# EAGLE design DryerSignal (EAGLE 8.3.2)
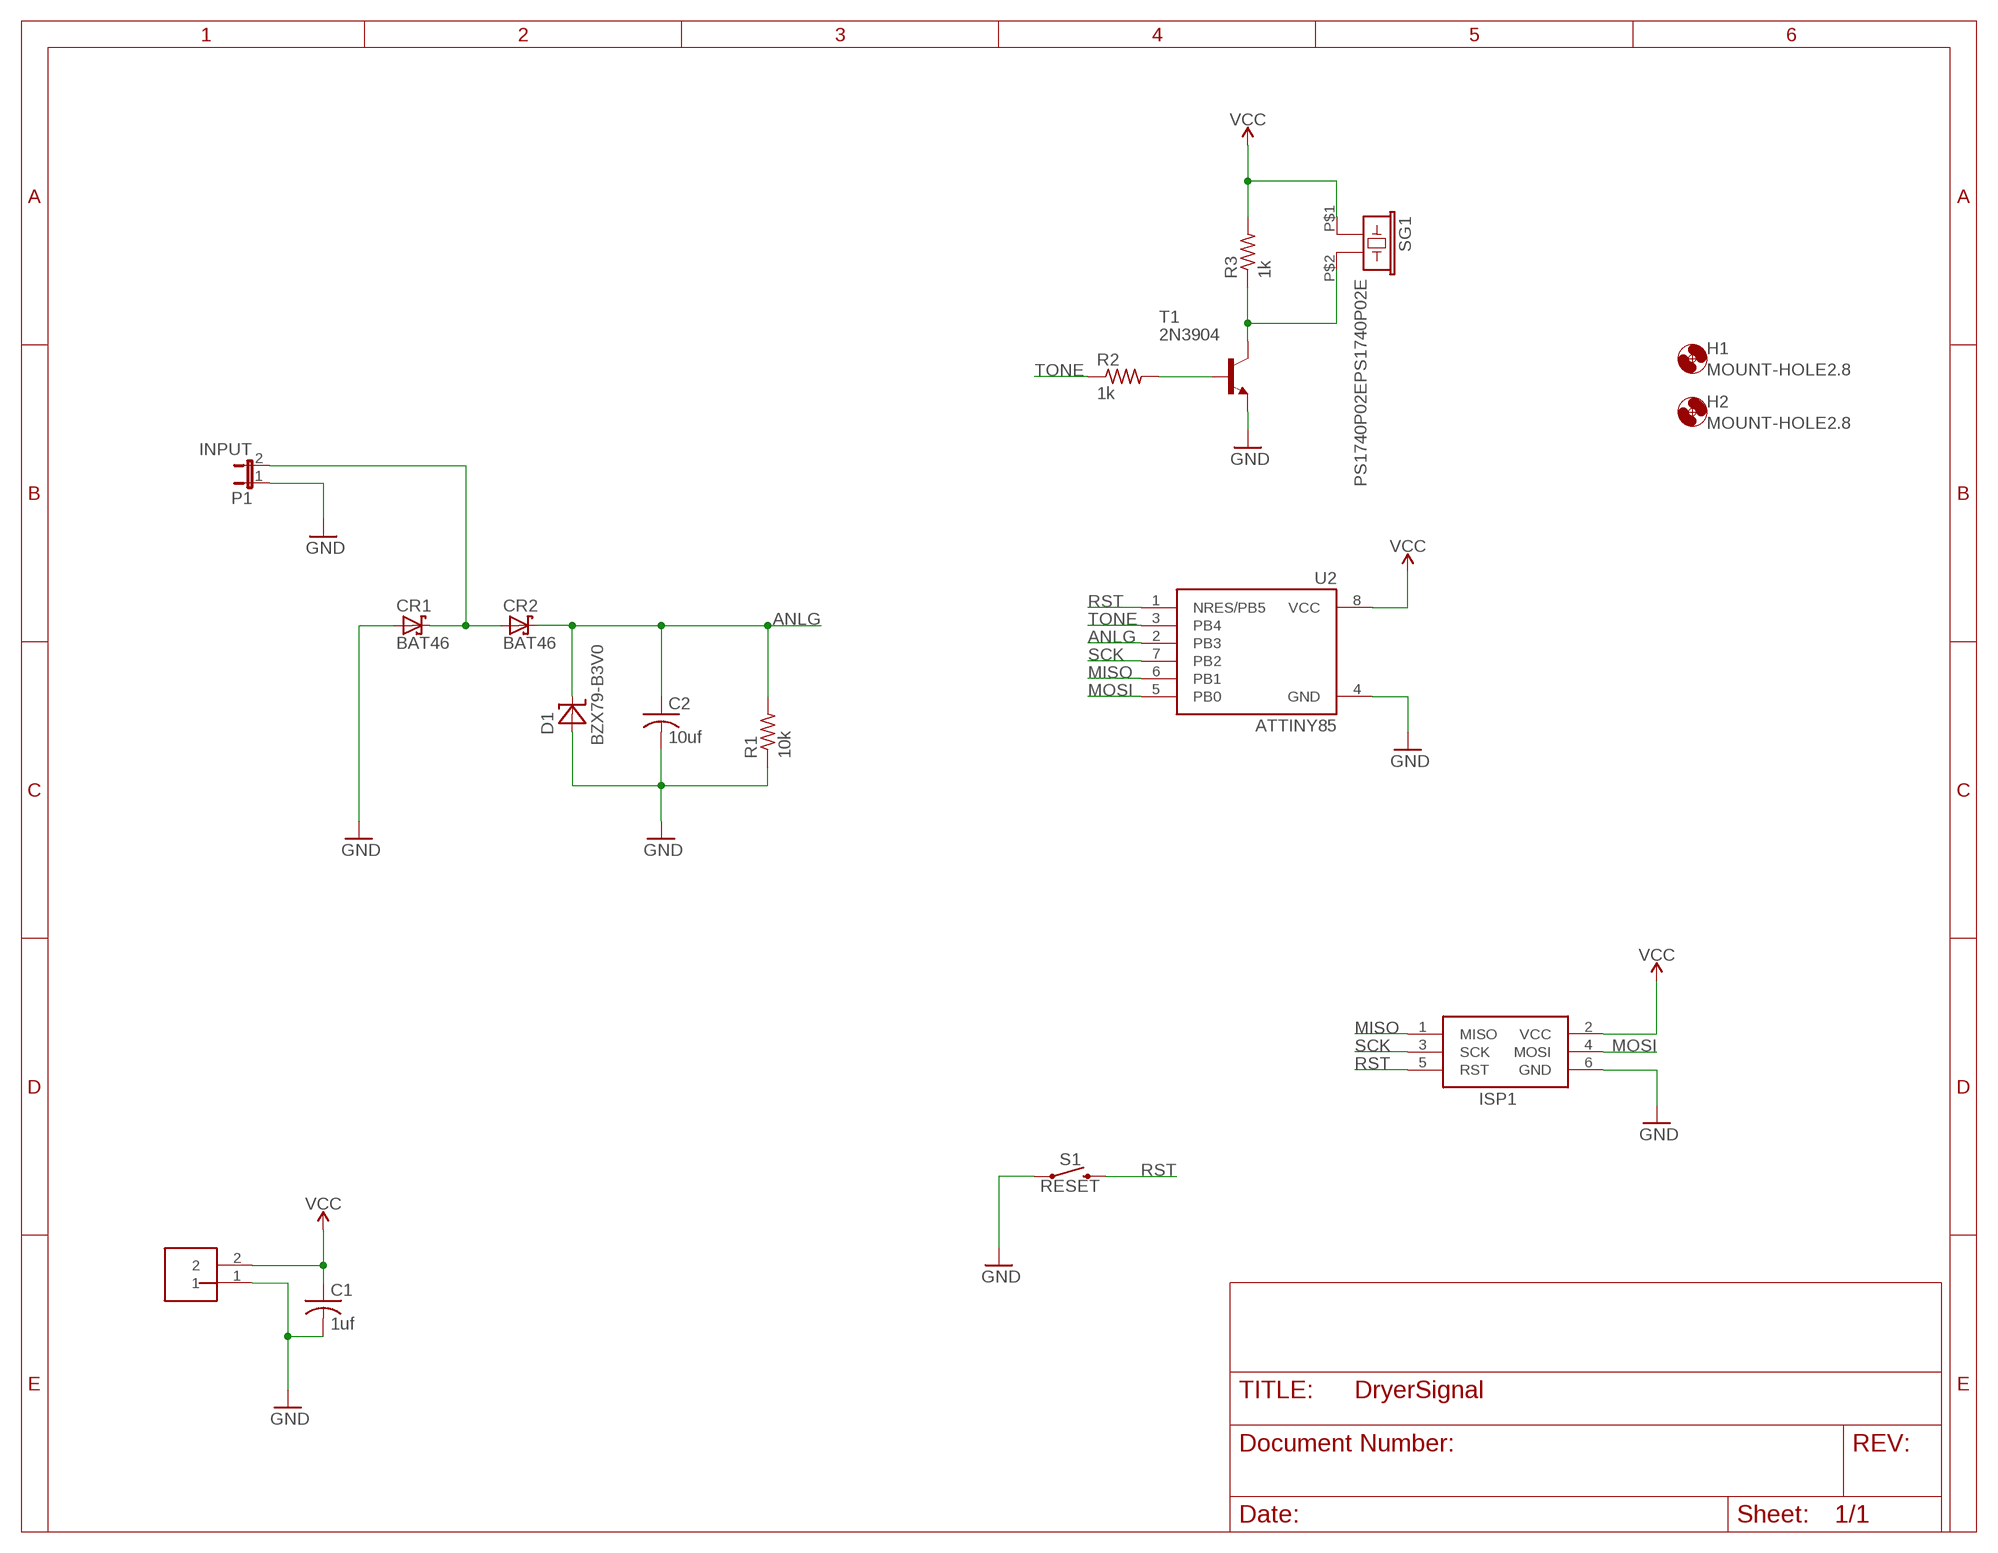
[diagram p0: schematic, sheet 1]

## Parts
C1  1uf  C-US050-025X075  [C050-025X075]
C2  10uf  C-US050-025X075  [C050-025X075]
CR1  BAT46  [DO35-10]
CR2  BAT46  [DO35-10]
D1  BZX79-B3V0  BZX79  [DO35-10]
H1  MOUNT-HOLE2.8  [2,8]
H2  MOUNT-HOLE2.8  [2,8]
ISP1  AVRISP-BOX  [AVRISP-BOX]
J1  4.5v  2_PIN_JST-XH  [2_PIN_JST-XH]
P1  INPUT  PINHEADER-1X02PTH  [1X02]
R1  10k  R-US_0207/10  [0207/10]
R2  1k  R-US_0207/10  [0207/10]
R3  1k  R-US_0207/10  [0207/10]
S1  RESET  MOMENTARY-SWITCH-SPST-PANEL-MOUNT  [1X02]
SG1  PS1740P02EPS1740P02E  [PS1740P02E]
T1  2N3904  [TO92]
U2  ATTINY85  ATTINY85V-10P  [PDIP08_300MIL]

## Nets
ANLG: C2.1 CR2.C D1.C R1.2 U2.2(PB3)
GND [power]: C1.2 C2.2 CR1.A D1.A ISP1.6(GND) J1.1 P1.1 R1.1 S1.1 T1.3(E) U2.4(GND)
INPUT: CR1.C CR2.A P1.2
MISO: ISP1.1(MISO) U2.6(PB1)
MOSI: ISP1.4(MOSI) U2.5(PB0)
N$1: R2.2 T1.2(B)
N$2: R3.1 SG1.P$2 T1.1(C)
RST: ISP1.5(RST) S1.2 U2.1(NRES/PB5)
SCK: ISP1.3(SCK) U2.7(PB2)
TONE: R2.1 U2.3(PB4)
VCC [power]: C1.1 ISP1.2(VCC) J1.2 R3.2 SG1.P$1 U2.8(VCC)

## Library data of the parts
C1 C2 = DryerSignal:C-US: CAPACITOR, American symbol
CR1 CR2 = DryerSignal:BAT46: Schottky Diode
D1 = DryerSignal:BZX79: Zener Diode
H1 H2 = DryerSignal:MOUNT-HOLE: MOUNTING HOLE with drill center marker
ISP1 = DryerSignal:AVRISP: AVR ISP HEADER Standard 6 pin header for AVR programming
J1 = DryerSignal:2_PIN_JST-XH: Corrected for XH 2 pin dmf 4.10.15 Source info: http://www.jst-mfg.com/product/pdf/eng/eXH.pdf Note: pin spacing is 2.5 mm Note: pins are 0.64 mm square cross section. This means the pin diagonal is 0.905 mm. Hole diameter spec'd by jst is 0.9 mm; hole diameter used here is 1.0 mm
P1 = DryerSignal:PINHEADER-1X02: Pin Header Connector Basic 0.1" spaced jumper. Use with breakaway headers.
R1-R3 = DryerSignal:R-US_: RESISTOR, American symbol
S1 = DryerSignal:MOMENTARY-SWITCH-SPST: Momentary Switch (Pushbutton) - SPST Normally-open (NO) SPST momentary switches (buttons, pushbuttons). Variants PTH-12MM - 12mm square, through-hole Momentary Pushbutton Switch - 12mm Square <https://www.sparkfun.com/products/9190> (COM-09190) PTH-6.0MM, PTH-6.0MM-KIT - 6.0mm square, through-hole Mini Pushbutton Switch <https://www.sparkfun.com/products/97> (COM-00097) KIT package intended for soldering kit's - only one side of pads' copper is exposed. PTH-RIGHT-ANGLE-KIT - Right-angle, through-hole Right Angle Tactile Button <https://www.sparkfun.com/products/10791> - Used on SparkFun BigTime Watch Kit <https://www.sparkfun.com/products/11734> SMD-12MM - 12mm square, surface-mount Tactile Button - SMD (12mm) <https://www.sparkfun.com/products/12993> (COM-12993) Used on SparkFun PicoBoard <https://www.sparkfun.com/products/11888> SMD-4.5MM - 4.5mm Square Trackball Switch Used on SparkFun Blackberry Trackballer Breakout <https://www.sparkfun.com/products/13169> SMD-4.6MMX2.8MM - 4.60mm x 2.80mm, surface mount Used on SparkFun SAMD21 Mini Breakout <https://www.sparkfun.com/products/13664> SMD-5.2MM, SMD-5.2-REDUNDANT - 5.2mm square, surface-mount Mini Pushbutton Switch - SMD <https://www.sparkfun.com/products/8720> (COM-08720) Used on Arduino Pro Mini <https://www.sparkfun.com/products/11114> REDUNDANT package connects both switch circuits together SMD-6.0X3.5MM - 6.0 x 3.5mm, surface mount Momentary Reset Switch SMD <https://www.sparkfun.com/products/8229> (COM-08229) SMD-6.2MM-TALL - 6.2mm square, surface mount Tactile Button - SMD (6mm) <https://www.sparkfun.com/products/12992> Used on SparkFun Digital Sandbox <https://www.sparkfun.com/products/12651> SMD-RIGHT-ANGLE - Right-angle, surface mount Used on SparkFun Block for Intel® Edison - Arduino <https://www.sparkfun.com/products/13036>
SG1 = DryerSignal:PS1740P02E: Piezoelectric Acoustic Transducer Source: Panbasonic .. 2SC1685.pdf
T1 = DryerSignal:2N3904: NPN TRANSISTOR
U2 = DryerSignal:ATTINY85*: ATMEL ATtiny 85 Packages: P = PDIP 08 30mil S = SOIC 08 EIAJ 208mil Technologies Note: for complete ordering code (temp. range, finish, tape&reel etc.) see www.atmel.com • Supply Voltage: V = (1.8…5.5)V | [blank] = (2.7…5.5)V • Speed: 10 = 10 MHz | 20 = 20 MHz Author: Dipl.-Ing. FH Rainer Bayer HHN Hochschule Heilbronn (Heilbronn University), rainer.bayer@hs-heilbronn.de Ingenieurbüro ing-rb, mail@ing-rb.de

## Net classes
1 power: width 0.508 mm

## Board
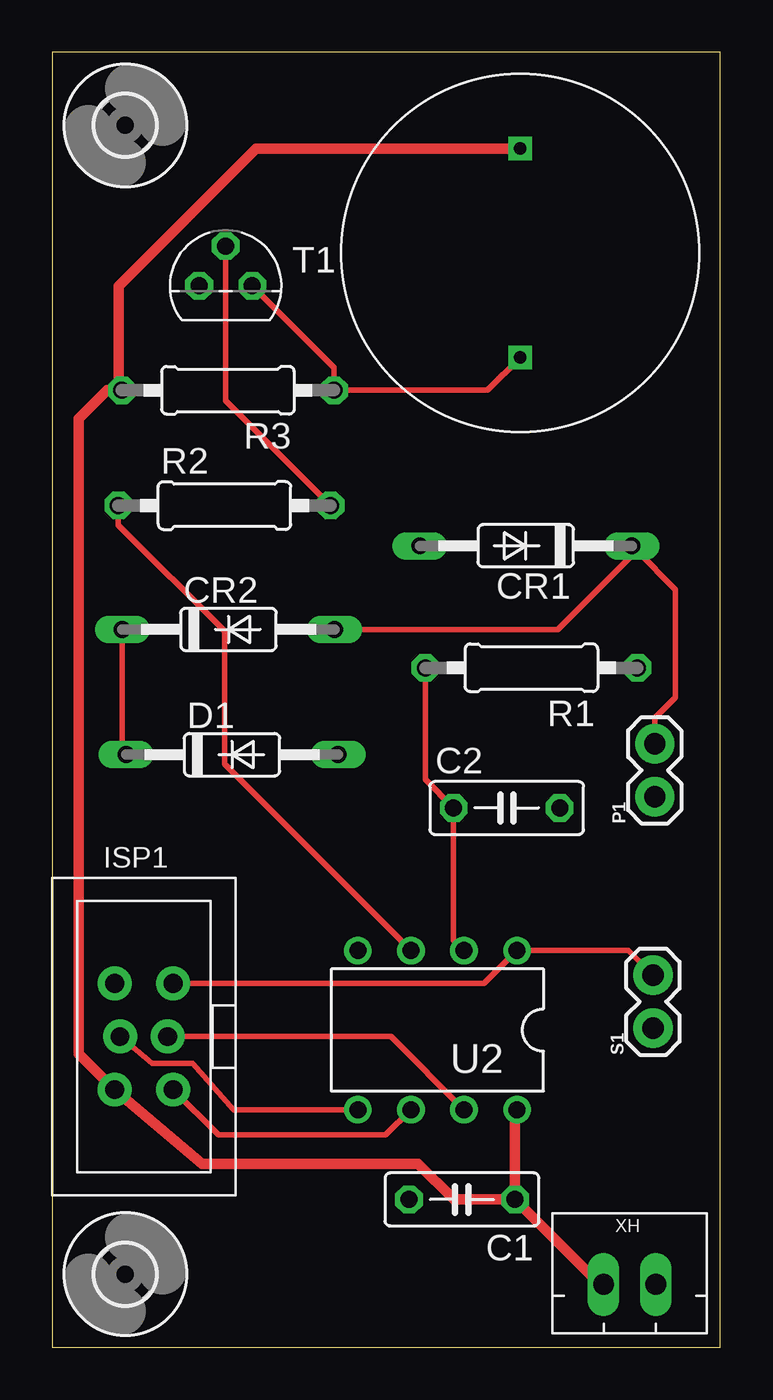
[diagram p1: board, top side]
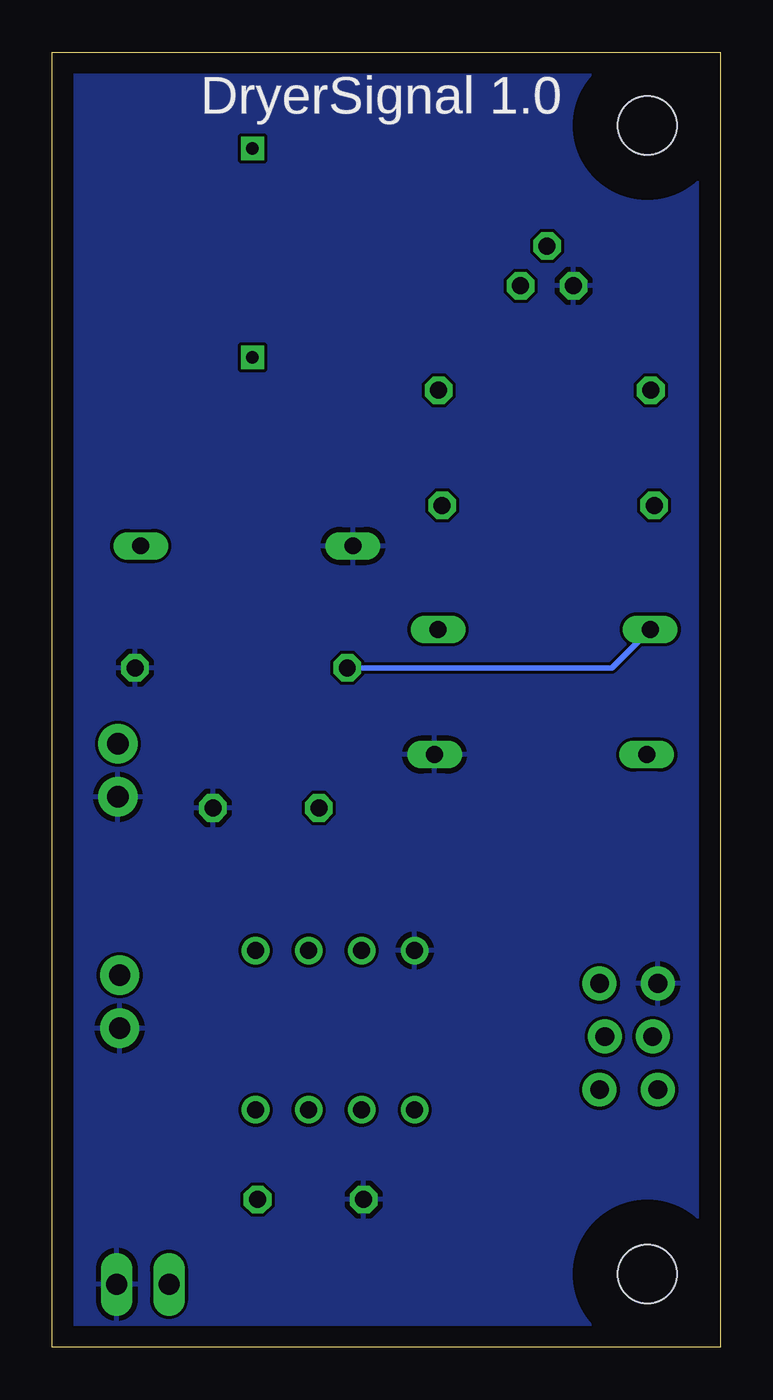
[diagram p2: board, bottom side, seen from below]

Size 32 x 62 mm. Coordinates in mm from the lower left corner, seen from the top.
Outline: 0,0 32,0 32,62 0,62 0,0
Copper layers (1*16): Top 0.035mm / dielectric 1.5mm / Bottom 0.035mm
Design rules "default": minimum track width 6mil, minimum drill 0.35mm, track to track 6mil, track to pad 6mil, pad to pad 6mil, via to via 6mil, smd to smd 6mil, copper to edge 40mil, drill to drill 6mil, minimum pad ring 10mil, minimum via ring 8mil, stop-mask expansion 4mil, vias tented up to drill 0mil, thermal gap 10mil

### Footprints (pad centres in the part's own frame; a part is rotated, then mirrored left to right if it is on the bottom)
C050-025X075 = drill 0.813 octagon: 1 -2.54,0; 2 2.54,0
DO35-10 = drill 0.813 long: A 5.08,0; C -5.08,0
2,8 = hole 2.8: 0,0
AVRISP-BOX = drill 0.9 pad 1.626: 1 -1.397,2.54; 2 1.397,2.54; 3 -1.143,0; 4 1.143,0; 5 -1.397,-2.54; 6 1.397,-2.54
2_PIN_JST-XH = drill 1 long: 1 2.45,3.4; 2 4.95,3.4
1X02 = drill 1.016 pad 1.88: 1 0,0; 2 2.54,0
0207/10 = drill 0.813 octagon: 1 -5.08,0; 2 5.08,0
PS1740P02E = drill 0.6 square: P$1 -5,0; P$2 5,0
TO92 = drill 0.813 octagon: 1 1.27,0; 2 0,1.905; 3 -1.27,0
PDIP08_300MIL = drill 0.813: 1 -3.81,-3.81; 2 -1.27,-3.81; 3 1.27,-3.81; 4 3.81,-3.81; 5 3.81,3.81; 6 1.27,3.81; 7 -1.27,3.81; 8 -3.81,3.81

### Placement (x,y rotation side)
C1  19.62,7.08 180 top
C2  21.77,25.82 0 top
CR1  22.68,38.37 180 top
CR2  8.44,34.37 0 top
D1  8.61,28.37 0 top
H1  3.5,3.5 0 top
H2  3.5,58.5 0 top
ISP1  4.39,14.88 180 top
J1  31.36,6.42 180 top
P1  28.86,26.36 90 top
R1  22.95,32.53 180 top
R2  8.25,40.3 0 top
R3  8.41,45.81 180 top
S1  28.77,15.28 90 top
SG1  22.41,52.39 270 top
T1  8.3,50.81 0 top
U2  18.45,15.19 180 top

### Tracks (layer width: path | path; a pad name or v marks a point on that pad's centre or on a via)
ANLG
  Top 0.254: D1.C 3.36,28.54 CR2.C | R1.2 17.87,27.18 C2.1 19.23,19.49 U2.2
  Bottom 0.254: CR2.C 5.2,32.53 R1.2
GND
  pour Bottom: 0,62 32,62 32,0 0,0
INPUT
  Top 0.254: 27.98,38.15 CR1.C | 27.98,38.15 29.84,36.28 29.84,31.11 28.86,30.12 P1.2 | CR2.A 24.21,34.37 27.98,38.15
MISO
  Top 0.254: U2.6 15.96,10.16 7.96,10.16 ISP1.1
MOSI
  Top 0.254: U2.5 8.69,11.38 6.73,13.59 4.79,13.59 ISP1.4
N$1
  Top 0.254: T1.2 8.3,45.33 R2.2
N$2
  Top 0.254: T1.1 13.49,46.9 R3.1 20.84,45.81 SG1.P$2
RST
  Top 0.254: S1.2 27.59,19 U2.1 20.68,17.41 ISP1.5
SCK
  Top 0.254: U2.7 16.22,14.88 ISP1.3
TONE
  Top 0.254: R2.1 3.17,39.38 8.26,34.29 8.26,27.92 U2.3
VCC
  Top 0.508: J1.2 26.23,3.02 C1.1 | C1.1 22.16,11.28 U2.8 | C1.1 19.23,7.08 17.53,8.78 7.19,8.78 ISP1.2 1.27,14.06 1.27,44.45 2.63,45.81 R3.2 3.17,45.98 3.17,50.8 9.77,57.39 SG1.P$1

### Text on the board
bPlace: DryerSignal 1.0